# Altium schematic sheet PS_MIO.SchDoc: ZoM Mod A - FPGA MIO Banks
size A4; Organization: Trenz Electronic GmbH / TT; DocumentNumber: 9; Revision: 01; SheetNumber: 9; SheetTotal: 13; Date: 12/16/2014
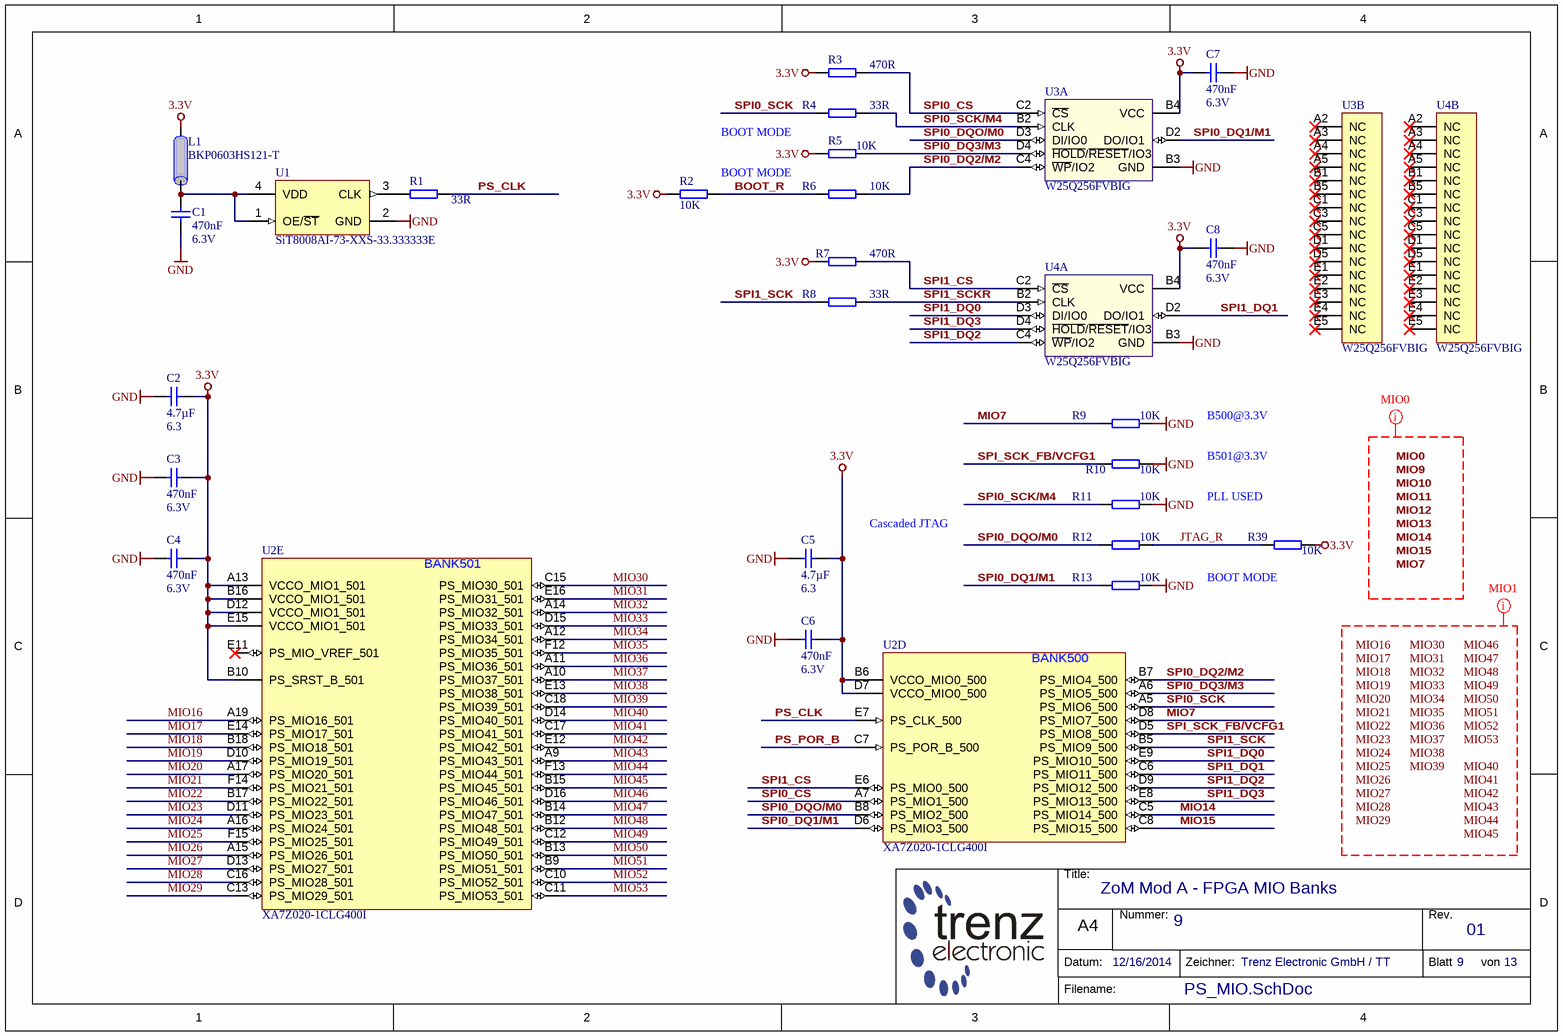
[diagram p0: PS_MIO.SchDoc]

## Parts
C1  470nF  Voltage: 6.3V  [CAPC0603X33N]
C2  4.7µF  Voltage: 6.3  [CAPC1005X60N]
C3  470nF  Voltage: 6.3V  [CAPC0603X33N]
C4  470nF  Voltage: 6.3V  [CAPC0603X33N]
C5  4.7µF  Voltage: 6.3  [CAPC1005X60N]
C6  470nF  Voltage: 6.3V  [CAPC0603X33N]
C7  470nF  Voltage: 6.3V  [CAPC0603X33N]
C8  470nF  Voltage: 6.3V  [CAPC0603X33N]
L1  BKP0603HS121-T  [INDC0603X33N]
R1  33R  [RESC0603X26N]
R2  10K  [RESC0603X26N]
R3  470R  [RESC1005X40N]
R4  33R  [RESC0603X26N]
R5  10K  [RESC0603X26N]
R6  10K  [RESC0603X26N]
R7  470R  [RESC1005X40N]
R8  33R  [RESC0603X26N]
R9  10K  [RESC0603X26N]
R10  10K  [RESC0603X26N]
R11  10K  [RESC0603X26N]
R12  10K  [RESC0603X26N]
R13  10K  [RESC0603X26N]
R39  10K  [RESC0603X26N]
U1  SiT8008AI-73-XXS-33.333333E  [2016]
U2  XA7Z020-1CLG400I  [BGA400C80P20X20_1700X1700X160N]  (parts D,E of 8)
U3  W25Q256FVBIG  [BGA24C100P5X5_800X600X120N]  (parts A,B of 2)
U4  W25Q256FVBIG  [BGA24C100P5X5_800X600X120N]  (parts A,B of 2)

## Nets
3.3V: C2.1 C3.1 C4.1 C5.1 C6.1 C7.1 C8.1 L1.1 R2.2 R3.1 R5.2 R7.2 R39.1 U2.A13(VCCO_MIO1_501) U2.B6(VCCO_MIO0_500) U2.B10(PS_SRST_B_501) U2.B16(VCCO_MIO1_501) U2.D7(VCCO_MIO0_500) U2.D12(VCCO_MIO1_501) U2.E15(VCCO_MIO1_501) U3.B4(VCC) U4.B4(VCC)
GND: C1.2 C2.2 C3.2 C4.2 C5.2 C6.2 C7.2 C8.2 R9.1 R10.1 R11.1 R13.1 U1.2(GND) U3.B3(GND) U4.B3(GND)
BOOT_R: R2.1 R6.2
JTAG_R: R12.1 R39.2
MIO7: R9.2 U2.D8(PS_MIO7_500)
MIO14: U2.C5(PS_MIO14_500)
MIO15: U2.C8(PS_MIO15_500)
MIO16: U2.A19(PS_MIO16_501)
MIO17: U2.E14(PS_MIO17_501)
MIO18: U2.B18(PS_MIO18_501)
MIO19: U2.D10(PS_MIO19_501)
MIO20: U2.A17(PS_MIO20_501)
MIO21: U2.F14(PS_MIO21_501)
MIO22: U2.B17(PS_MIO22_501)
MIO23: U2.D11(PS_MIO23_501)
MIO24: U2.A16(PS_MIO24_501)
MIO25: U2.F15(PS_MIO25_501)
MIO26: U2.A15(PS_MIO26_501)
MIO27: U2.D13(PS_MIO27_501)
MIO28: U2.C16(PS_MIO28_501)
MIO29: U2.C13(PS_MIO29_501)
MIO30: U2.C15(PS_MIO30_501)
MIO31: U2.E16(PS_MIO31_501)
MIO32: U2.A14(PS_MIO32_501)
MIO33: U2.D15(PS_MIO33_501)
MIO34: U2.A12(PS_MIO34_501)
MIO35: U2.F12(PS_MIO35_501)
MIO36: U2.A11(PS_MIO36_501)
MIO37: U2.A10(PS_MIO37_501)
MIO38: U2.E13(PS_MIO38_501)
MIO39: U2.C18(PS_MIO39_501)
MIO40: U2.D14(PS_MIO40_501)
MIO41: U2.C17(PS_MIO41_501)
MIO42: U2.E12(PS_MIO42_501)
MIO43: U2.A9(PS_MIO43_501)
MIO44: U2.F13(PS_MIO44_501)
MIO45: U2.B15(PS_MIO45_501)
MIO46: U2.D16(PS_MIO46_501)
MIO47: U2.B14(PS_MIO47_501)
MIO48: U2.B12(PS_MIO48_501)
MIO49: U2.C12(PS_MIO49_501)
MIO50: U2.B13(PS_MIO50_501)
MIO51: U2.B9(PS_MIO51_501)
MIO52: U2.C10(PS_MIO52_501)
MIO53: U2.C11(PS_MIO53_501)
PS_CLK: R1.2 U2.E7(PS_CLK_500)
PS_POR_B: U2.C7(PS_POR_B_500)
SPI0_CS: R3.2 U2.A7(PS_MIO1_500) U3.C2(~{CS})
SPI0_DQ1/M1: R13.2 U2.D6(PS_MIO3_500) U3.D2(DO/IO1)
SPI0_DQ2/M2: R6.1 U2.B7(PS_MIO4_500) U3.C4(~{WP}/IO2)
SPI0_DQ3/M3: R5.1 U2.A6(PS_MIO5_500) U3.D4(~{HOLD}/~{RESET}/IO3)
SPI0_DQO/M0: R12.2 U2.B8(PS_MIO2_500) U3.D3(DI/IO0)
SPI0_SCK: R4.1 U2.A5(PS_MIO6_500)
SPI0_SCK/M4: R4.2 R11.2 U3.B2(CLK)
SPI1_CS: R7.1 U2.E6(PS_MIO0_500) U4.C2(~{CS})
SPI1_DQ0: U2.E9(PS_MIO10_500) U4.D3(DI/IO0)
SPI1_DQ1: U2.C6(PS_MIO11_500) U4.D2(DO/IO1)
SPI1_DQ2: U2.D9(PS_MIO12_500) U4.C4(~{WP}/IO2)
SPI1_DQ3: U2.E8(PS_MIO13_500) U4.D4(~{HOLD}/~{RESET}/IO3)
SPI1_SCK: R8.1 U2.B5(PS_MIO9_500)
SPI1_SCKR: R8.2 U4.B2(CLK)
SPI_SCK_FB/VCFG1: R10.2 U2.D5(PS_MIO8_500)
NetC1_1: C1.1 L1.2 U1.1(OE/~{ST}) U1.4(VDD)
NetR1_1: R1.1 U1.3(CLK)

Not connected (* = marked no-connect by the designer): U2 E11(PS_MIO_VREF_501)*; U3 A2(NC)* A3(NC)* A4(NC)* A5(NC)* B1(NC)* B5(NC)* C1(NC)* C3(NC)* C5(NC)* D1(NC)* D5(NC)* E1(NC)* E2(NC)* E3(NC)* E4(NC)* E5(NC)*; U4 A2(NC)* A3(NC)* A4(NC)* A5(NC)* B1(NC)* B5(NC)* C1(NC)* C3(NC)* C5(NC)* D1(NC)* D5(NC)* E1(NC)* E2(NC)* E3(NC)* E4(NC)* E5(NC)*

## Layout directives
net class MIO1: MIO16, MIO17, MIO18, MIO19, MIO20, MIO21, MIO22, MIO23, MIO24, MIO25, MIO26, MIO27, MIO28, MIO29, MIO30, MIO31, MIO32, MIO33, MIO34, MIO35, MIO36, MIO37, MIO38, MIO39, MIO40, MIO41, MIO42, MIO43, MIO44, MIO45, MIO46, MIO47, MIO48, MIO49, MIO50, MIO51, MIO52, MIO53
net class MIO0: MIO0, MIO7, MIO9, MIO10, MIO11, MIO12, MIO13, MIO14, MIO15

## Notes on the sheet
- BOOT MODE
- (near R2) BOOT MODE
- B500@3.3V
- B501@3.3V
- PLL USED
- Cascaded JTAG
- (near R39) BOOT MODE
- Labels drawn without touching a wire or pin: MIO0, MIO7, MIO9, MIO10, MIO11, MIO12, MIO13, MIO14, MIO15, MIO16, MIO17, MIO18, MIO19, MIO20, MIO21, MIO22, MIO23, MIO24, MIO25, MIO26, MIO27, MIO28, MIO29, MIO30, MIO31, MIO32, MIO33, MIO34, MIO35, MIO36, MIO37, MIO38, MIO39, MIO40, MIO41, MIO42, MIO43, MIO44, MIO45, MIO46, MIO47, MIO48, MIO49, MIO50, MIO51, MIO52, MIO53
- Title:
- Nummer:
- Rev.
- Datum:
- A4
- Zeichner:
- Blatt
- von
- Filename:
- (in symbol 25981, part D) BANK500
- (in symbol 25981, part E) BANK501

## Library data of the parts
C1 C3 C4 C6-C8 = 24921: KON 470nF X5R 6.3V SMD; AN: 24921; Value: 470n; Tolerance: 20%; Mixed: SMT; Preferred: Yes; Case: 0603 (0201); Technology: X5R
C2 C5 = 24719: KON 4.7µF 6.3V X5R SMD; AN: 24719; Value: 4.7u; Mixed: SMT; Preferred: Yes; Case: 1005 (0402); Technology: X5R
L1 = 25393: Ferritdurchführung SMD 0201; AN: 25393; Mixed: SMT; Trenz-Stock: Yes; Case: 0603 (0201); HelpURL: B:\AD\adlib\datasheet\MULTILAYER CHIP BEAD INDUCTORS BK; Preferred: Yes
R1 R4 = 25021: WID SMD 33R 1% 0,05W; AN: 25021; Value: 33; Mixed: SMT; Preferred: Yes; Case: 0603 (0201); HelpURL: B:\AD\adlib\datasheet\R0201
R2 R5 R6 R9-R13 R39 = 24914: WID SMD 10K 1% 0,05W; AN: 24914; Mixed: SMT; Preferred: Yes; Case: 0603 (0201); Value: 10K; HelpURL: B:\AD\adlib\datasheet\R0201; Tolerance: 1%
R3 R7 = 22769: WID SMD 470R 1% 0,063W; AN: 22769; Value: 470; Mixed: SMT; Preferred: Yes; Case: 1005 (0402); Tolerance: 1%
R8 = 25021: WID SMD 33R 1% 0,05W; AN: 25021; Mixed: SMT; Value: 33; Preferred: Yes; Case: 0603 (0201); HelpURL: B:\AD\adlib\datasheet\R0201
U1 = 25023: SiT8008AI-73-XXS-33.333333E MEMS Oszillator 33.333333MHz; AN: 25023; Value: 33M; Trenz-Stock: Yes; Mixed: SMT; Case: 2.0  x 1.6mm; HelpURL: B:\AD\adlib\datasheet\SiT8008; Preferred: Yes
U2 = 25981: AN: 25981; Mixed: SMT; Trenz-Stock: Yes; Case: CLG400; HelpURL: B:\AD\adlib\datasheet\XC7
U3 U4 = 25017: AN: 25017; Trenz-Stock: Yes; Mixed: SMT; Case: TFBGA24; HelpURL: B:\AD\adlib\datasheet\W25Q256FV; Preferred: Yes